# EAGLE design Breakout (EAGLE 7.6.0)
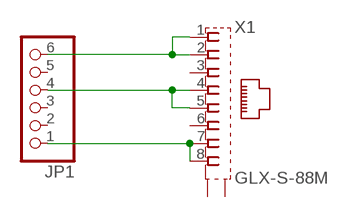
[diagram p0: schematic, sheet 1]

## Parts
JP1  PINHD-1X6  [1X06]
X1  GLX-S-88M  [GLX-S-88M]

## Nets
N$1: JP1.6 X1.1 X1.2
N$2: JP1.4 X1.4 X1.5
N$3: JP1.1 X1.7 X1.8
Unconnected: JP1.2 JP1.3 JP1.5 X1.3 X1.6 X1.S1 X1.S2

## Library data of the parts
JP1 = adafruit:PINHD-1X6: PIN HEADER
X1 = con-kycon:GLX-S-88M: Mod. Jack, Right Angle, 8 posiotion, 8 contatcs RJ45 Source: GLX-S-88M.pdf; OC_FARNELL: unknown; OC_NEWARK: unknown

## Board
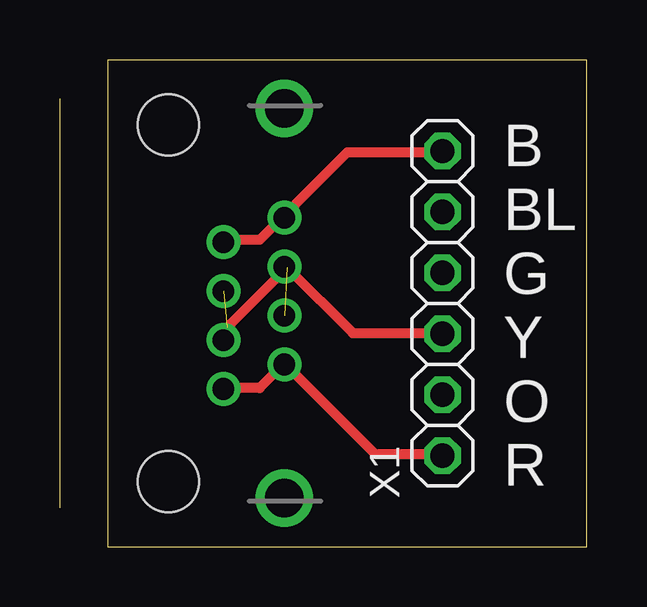
[diagram p1: board, top side]
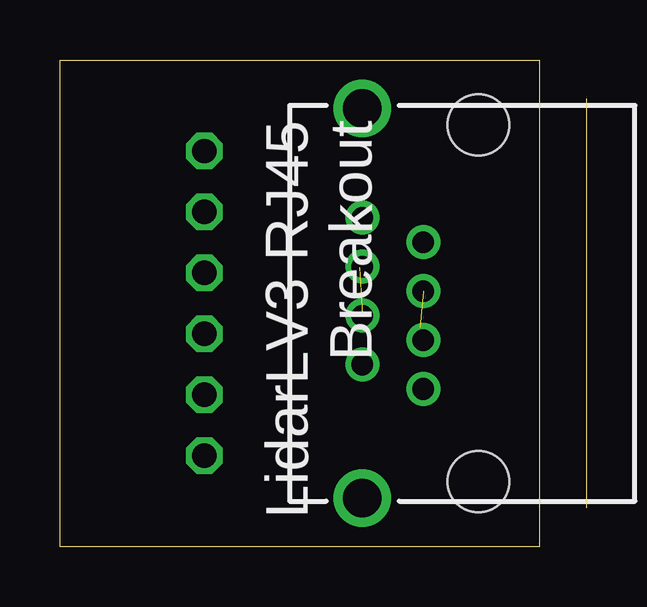
[diagram p2: board, bottom side, seen from below]

Size 19.99 x 20.31 mm. Coordinates in mm from the lower left corner, seen from the top.
Outline: 0,0 19.99,0 19.99,20.31 0,20.31 0,0
Copper layers (1*16): Top 0.035mm / dielectric 1.5mm / Bottom 0.035mm
Design rules "default": minimum track width 10mil, minimum drill 24mil, track to track 8mil, track to pad 8mil, pad to pad 8mil, via to via 8mil, smd to smd 8mil, copper to edge 40mil, drill to drill 8mil, minimum pad ring 10mil, minimum via ring 8mil, stop-mask expansion 4mil, vias tented up to drill 0mil, thermal gap 10mil

### Footprints (pad centres in the part's own frame; a part is rotated, then mirrored left to right if it is on the bottom)
1X06 = drill 1.016 octagon: 1 -6.35,0; 2 -3.81,0; 3 -1.27,0; 4 1.27,0; 5 3.81,0; 6 6.35,0
GLX-S-88M = drill 0.9 pad 1.422: 1 -3.57,-2.3; 2 -2.55,-4.84; 3 -1.53,-2.3; 4 -0.51,-4.84; 5 0.51,-2.3; 6 1.53,-4.84; 7 2.55,-2.3; 8 3.57,-4.84 | drill 1.6 pad 2.184: S1 -8.125,-4.84; S2 8.125,-4.84 | hole 2.55: -7.44,0; 7.44,0

### Placement (x,y rotation side)
JP1  13.97,10.16 270 top
X1  2.54,10.16 90 top

### Tracks (layer width: path | path; a pad name or v marks a point on that pad's centre or on a via)
N$1
  Top 0.406: X1.1 4.98,6.63 6.35,6.63 7.26,7.54 X1.2 7.49,7.54 11.15,3.89 13.89,3.89 JP1.6
N$2  (2 unrouted)
  Top 0.406: 4.98,8.69 4.98,9.14 7.49,11.66 10.24,8.91 13.89,8.91 JP1.4
N$3
  Top 0.406: X1.7 4.98,12.8 6.35,12.8 7.26,13.72 X1.8 7.49,13.95 10.01,16.46 13.89,16.46 JP1.1

### Text on the board
tPlace: B / BL / G / Y / O / R
bPlace: LidarLV3 RJ45 / Breakout